# EasyEDA Pro project 天猛星MSPM0.epro, board 2.0
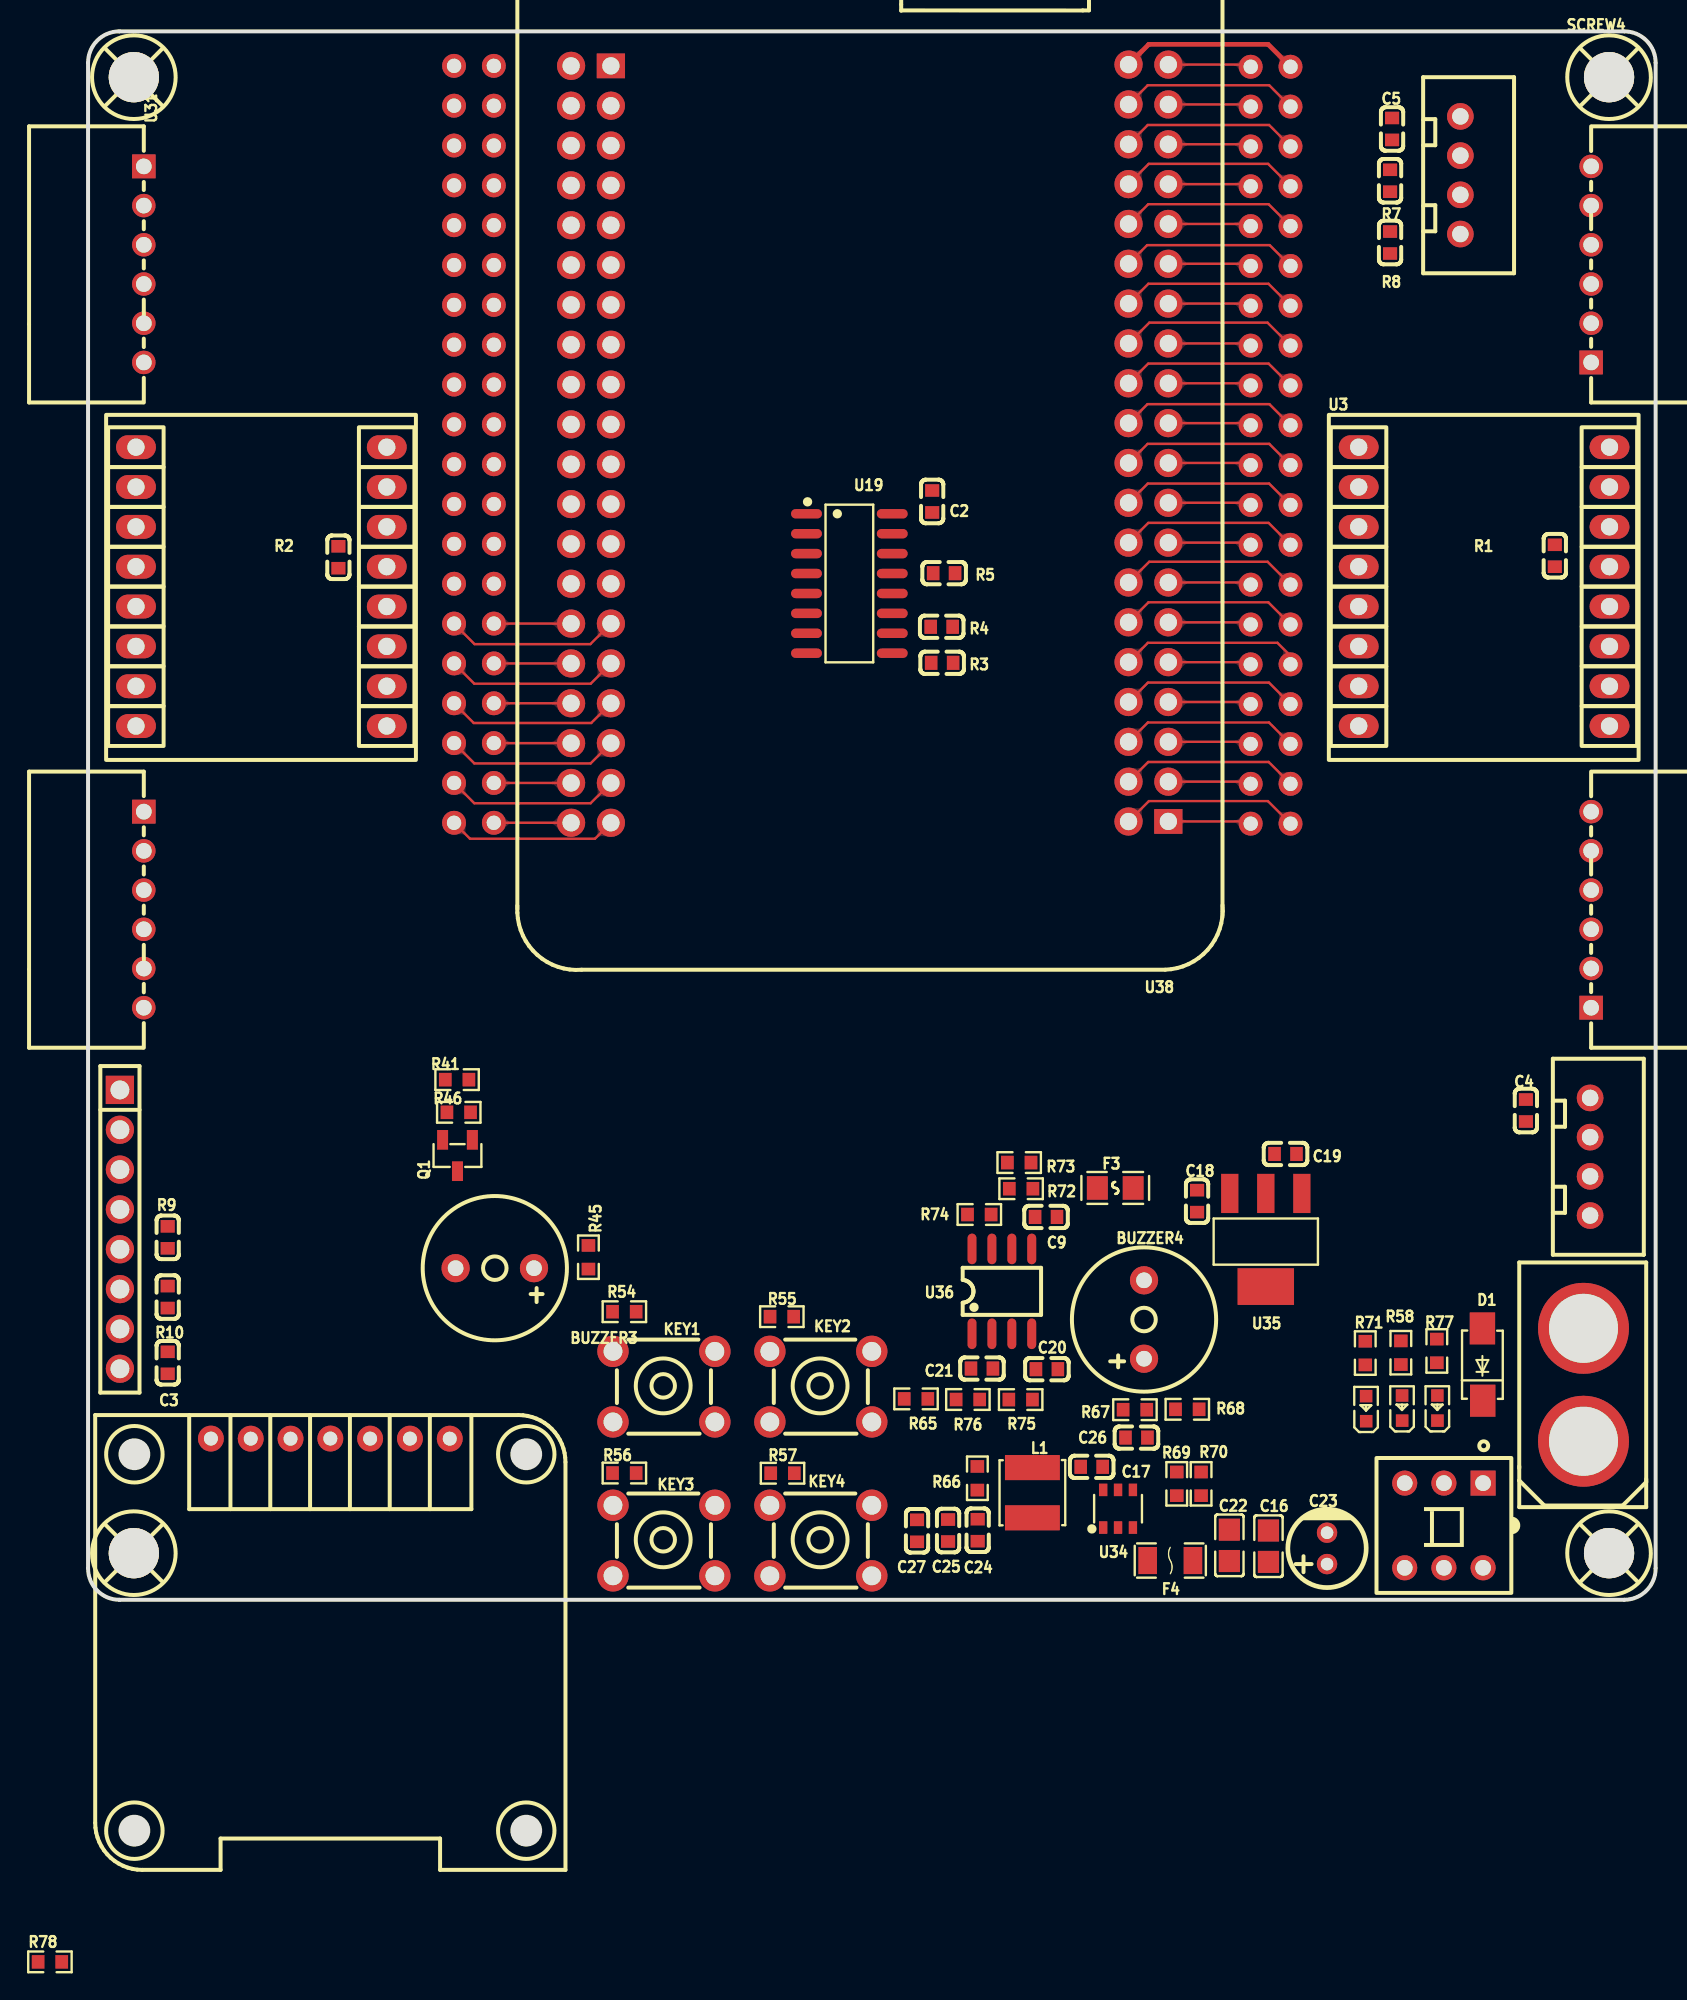
[diagram p1: board, top side]
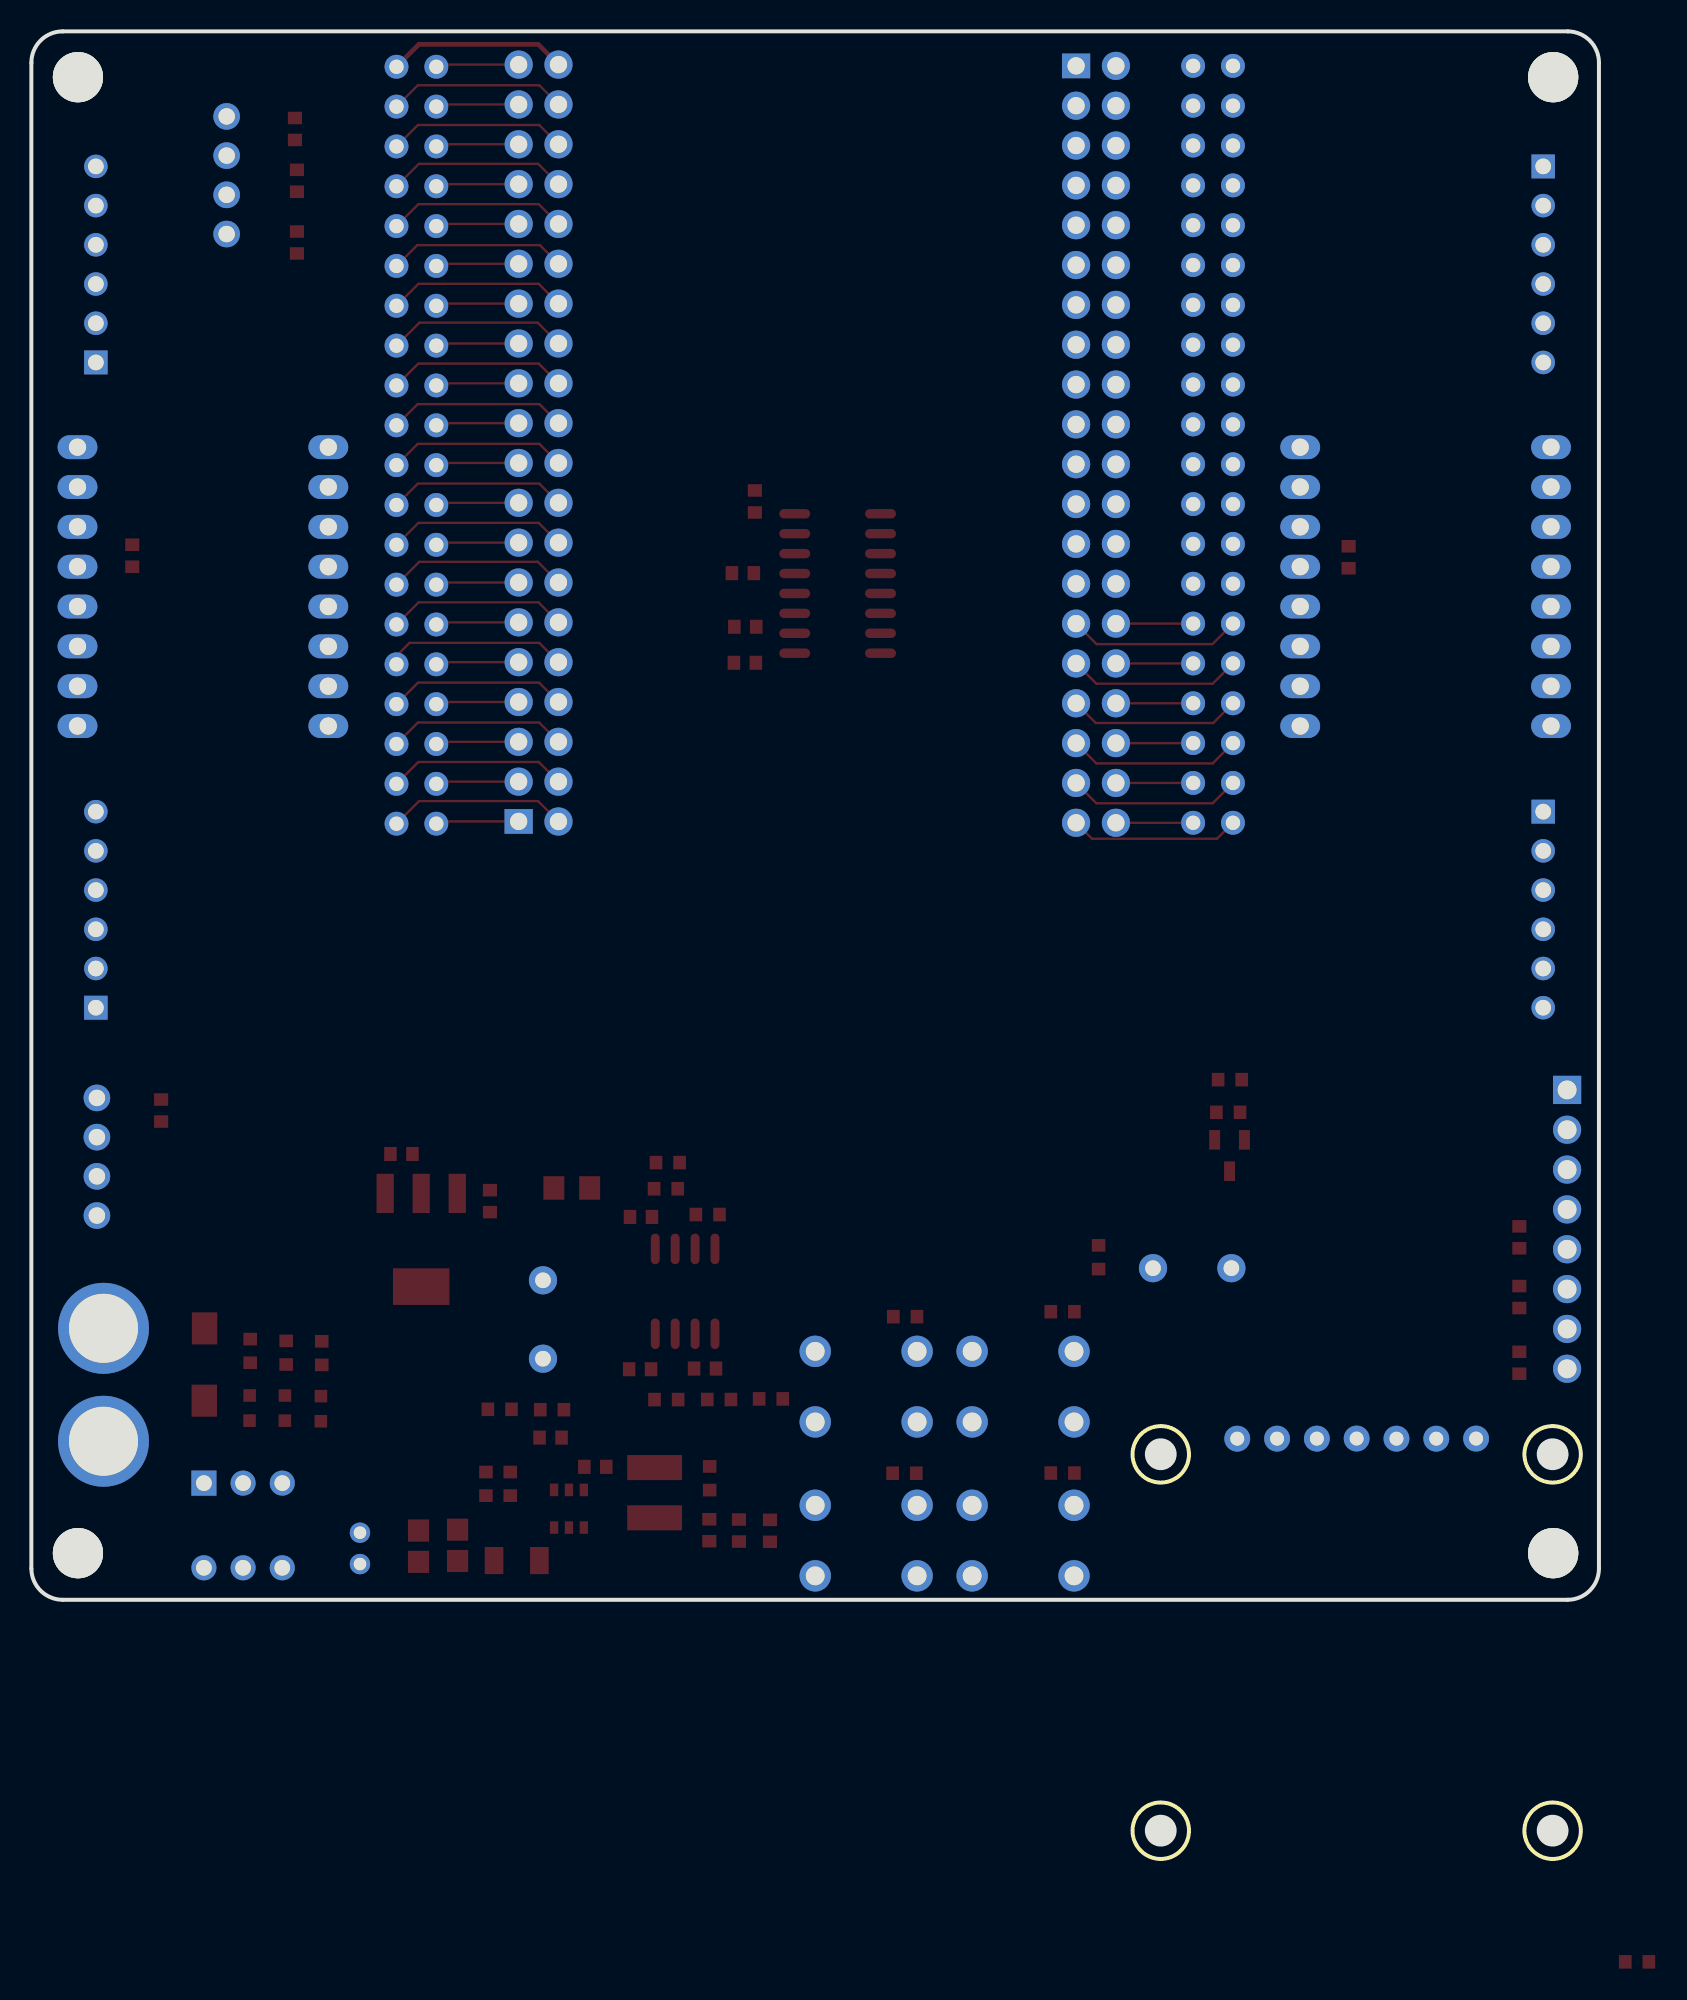
[diagram p2: board, bottom side, seen from below]

Outline 100 x 115.73 mm; copper layers: Top Layer, Bottom Layer. Coordinates in mm from the lower left corner of the outline.
Outline path: 0,113.73 0,17.73 arc(0.59,16.32) 2,15.73 98,15.73 arc(99.41,16.32) 100,17.73 100,113.73 arc(99.41,115.15) 98,115.73 2,115.73 arc(0.59,115.15) 0,113.73
Stack: Top Layer 0.035mm / Dielectric1 1.51mm FR4 er 4.5 / Bottom Layer 0.035mm

## Design rules (mm)
net M2_O2: 12
net M2_O1: 12
net M1_O2: 12
net M1_O1: 12
net 5V: 5
net 12V: 12
net M4_O2: 12
net M4_O1: 12
net M3_O2: 12
net M3_O1: 12
net +3.3V: 3.3
net +12V: 12
net DC5V: 5
net DC12V: 12
template: TI板
spacing copperThickness1oz (default): track to track 0.203, other pairs 0.152 to 0.203
spacing copperThickness2oz: track to track 0.203, other pairs 0.152 to 0.3
track width 信号线 (default): min 0.152, default 0.152, max 0.152
track width 12v: min 0.762, default 0.762, max 0.762
track width 3v3: min 0.3, default 0.3, max 0.4
track width 5电源线: min 0.3, default 0.5, max 2.54
differential pair differentialPair (default): width min 0.152, default 0.152, max 0.152; gap min 0.152, default 0.152
via 信号线孔 (default): diameter min 0.508, default 0.508, max 0.508; hole min 0.254, default 0.254, max 0.305
via 12v: diameter min 0.762, default 1.27, max 2.032; hole min 0.762, default 0.889, max 2.032
via 3v3: diameter min 0.4, default 0.6, max 1; hole min 0.4, default 0.4, max 0.6
via 5v电源: diameter min 0.5, default 0.8, max 10; hole min 0.3, default 0.6, max 6.3
net class 5 uses 5v电源, 5电源线
net class 12 uses 12v
net class 3.3 uses 3v3
net M2_O2 uses 12v
net M2_O1 uses 12v
net M1_O2 uses 12v
net M1_O1 uses 12v
net 5V uses 5v电源, 5电源线
net 12V uses 12v
net M4_O2 uses 12v
net M4_O1 uses 12v
net M3_O2 uses 12v
net M3_O1 uses 12v
net +3.3V uses 3v3
net +12V uses 12v
net DC5V uses 5v电源, 5电源线
net DC12V uses 12v

## Placement (name value [footprint] x y rotation side)
BUZZER3  3kHz  [BUZ-TH_BD9.0-P5.00-D0.6-FD]  25.95 36.88 180 top
BUZZER4  3kHz  [BUZ-TH_BD9.0-P5.00-D0.6-FD]  67.36 33.6 90 top
C2  100nF  [C0603]  53.85 85.76 90 top
C3  100nF  [C0603]  5.08 30.84 270 top
C4  100nF  [C0603]  91.72 46.93 270 top
C5  100nF  [C0603]  83.19 109.51 270 top
C9  100nF  [C0603]  61.11 40.14 180 top
C16  10uF  [C0805]  75.3 19.15 270 top
C17  100nF  [C0603]  64.03 24.21 0 top
C18  100nF  [C0603]  70.75 41.15 90 top
C19  100nF  [C0603]  76.39 44.16 180 top
C20  100nF  [C0603]  61.17 30.44 180 top
C21  1NF  [C0603]  57.02 30.48 0 top
C22  100nF  [C0805]  72.81 19.2 270 top
C23  47uF  [CAP-TH_BD5.0-P2.00-D0.8-FD]  79.04 19.01 90 top
C24  0.1uF  [C0603]  56.75 20.17 90 top
C25  22uF  [C0603]  54.86 20.15 90 top
C26  75pf  [C0603]  66.88 26.07 180 top
C27  22uF  [C0603]  52.88 20.13 90 top
D1  SS54  [SMA_L4.3-W2.6-LS5.0-FD]  88.96 30.73 270 top
F3  SMD0805-050-24  [F0805]  65.53 41.99 0 top
F4  nSMD010  [F1206]  69.04 18.23 180 top
H1  -  [HDR-TH_8P-P2.54-V-F-1]  2.03 39.35 270 top
KEY1  按键开关6*6*8  [KEY-TH_4P-L6.0-W6.0-P4.50-LS7.5]  36.74 29.32 0 top
KEY2  按键开关6*6*8  [KEY-TH_4P-L6.0-W6.0-P4.50-LS7.5]  46.75 29.32 0 top
KEY3  按键开关6*6*8  [KEY-TH_4P-L6.0-W6.0-P4.50-LS7.5]  36.74 19.51 0 top
KEY4  按键开关6*6*8  [KEY-TH_4P-L6.0-W6.0-P4.50-LS7.5]  46.75 19.51 0 top
L1  10uH  [IND-SMD_L4.0-W4.0]  60.24 22.56 270 top
LED2  -  [LED_0603]  83.82 28.01 90 top
LED4  -  [LED_0603]  81.52 27.97 90 top
LED5  -  [LED_0603]  86.07 28.01 90 top
Q1  AO3400A  [SOT-23-3_L2.9-W1.3-P1.90-LS2.4-BR]  23.57 44.06 90 top
R1  10K  [C0603]  93.57 82.3 90 top
R2  10K  [C0603]  15.97 82.2 90 top
R3  10K  [C0603]  54.48 75.47 0 top
R4  10K  [C0603]  54.46 77.77 0 top
R5  10K  [C0603]  54.61 81.19 0 top
R7  4.7K  [C0603]  83.06 106.21 270 top
R8  4.7K  [C0603]  83.06 102.27 90 top
R9  4.7K  [C0603]  5.08 38.84 270 top
R10  4.7K  [C0603]  5.08 35.03 90 top
R41  22R  [R0603]  23.54 48.9 180 top
R45  100R  [R0603]  31.92 37.57 270 top
R46  10K  [R0603]  23.65 46.81 0 top
R54  10K  [R0603]  34.21 34.1 180 top
R55  10K  [R0603]  44.26 33.78 180 top
R56  10K  [R0603]  34.21 23.81 180 top
R57  10K  [R0603]  44.3 23.8 180 top
R58  10K  [R0603]  83.75 31.49 90 top
R65  47K  [R0603]  52.82 28.54 0 top
R66  49.9  [R0603]  56.73 23.48 270 top
R67  100K  [R0603]  66.78 27.85 180 top
R68  13.3K  [R0603]  70.12 27.88 180 top
R69  511K  [R0603]  69.45 23.13 270 top
R70  105K  [R0603]  71 23.13 90 top
R71  2k  [R0603]  81.48 31.46 90 top
R72  100R  [R0603]  59.52 41.94 180 top
R73  10K  [R0603]  59.4 43.61 180 top
R74  75K  [R0603]  56.86 40.3 180 top
R75  150K  [R0603]  59.49 28.5 180 top
R76  36K  [R0603]  56.13 28.5 180 top
R77  5K  [R0603]  86.04 31.6 90 top
R78  0R  [R0603]  -2.43 -7.35 0 top
SCREW1  -  [M3螺丝]  2.92 18.7 0 top
SCREW2  -  [M3螺丝]  97.03 18.7 0 top
SCREW3  -  [M3螺丝]  2.92 112.81 0 top
SCREW4  -  [M3螺丝]  97.03 112.81 0 top
SW2  XKB8585-Z-150  [SW-TH_6P-L8.5-W8.5-P2.50-LS5.4-BL-1]  86.49 20.47 180 top
U3  -  [TB6612]  79 69.23 0 top
U4  -  [TB6612]  1 69.23 0 top
U11  OLED_SPI  [0.96OLED_7P]  15.45 26.01 0 top
U18  PCA9555  [CONN-TH_4P-P2.50-XH2.54-4P]  87.54 106.56 90 top
U19  74HC595D,118  [SOIC-16_L9.9-W3.9-P1.27-LS6.0-BL]  48.57 80.53 270 top
U21  UART1  [CONN-TH_4P-P2.50-XH2.54-4P]  95.82 43.98 90 top
U29  ZX-XH2.54-6PWZ  [CONN-TH_6P-P2.50_ZX-XH2.54-6PWZ]  95.88 100.87 90 top
U30  ZX-XH2.54-6PWZ  [CONN-TH_6P-P2.50_ZX-XH2.54-6PWZ]  95.88 59.73 90 top
U31  ZX-XH2.54-6PWZ  [CONN-TH_6P-P2.50_ZX-XH2.54-6PWZ]  3.56 100.87 270 top
U32  ZX-XH2.54-6PWZ  [CONN-TH_6P-P2.50_ZX-XH2.54-6PWZ]  3.56 59.73 270 top
U34  TPS54302DDCT  [TSOT-23-6_L2.9-W1.6-P0.95-LS2.8-BR]  65.71 21.54 270 top
U35  A1117-3.3  [SOT-223-3_L6.5-W3.4-P2.30-LS7.0-BR-1]  75.13 38.67 90 top
U36  TPS25921ADR  [SOIC-8_L5.0-W4.0-P1.27-LS6.0-BL]  58.29 35.4 0 top
U37  XT60  [CONN-TH_XT60]  95.4 29.44 90 top
U38  LCKFB-TMX-MSPM0G3507  [COMM-TH_LCKFB-TMX-MSPM0G3507]  49.86 89.44 180 top

## Footprints (pads in the part's own frame, mm; a bottom-side part is the same pattern mirrored in y, then rotated)
0.96OLED_7P
  round 1.651 hole 0.889: 1(-7.617,0.003) 2(-5.077,-0.003) 3(-2.538,-0.003) 4(0.003,0.005) 5(2.54,0) 6(5.08,0) 7(7.62,-0.003)
BUZ-TH_BD9.0-P5.00-D0.6-FD
  round 1.8 hole 1: 1(-2.5,0) 2(2.5,0)
C0603
  rect 0.8x0.9 smd: 1(-0.7,0) 2(0.7,0)
C0805
  rect 1.41x1.35 smd: 1(-1,0) 2(1,0)
CAP-TH_BD5.0-P2.00-D0.8-FD
  round 1.3 hole 0.8: 1(-1,0) 2(1,0)
COMM-TH_LCKFB-TMX-MSPM0G3507
  round 1.524 hole 0.914: 1(-24.303,24.227) 2(-26.843,24.227) 3(-24.303,21.688) 4(-26.843,21.688) 5(-24.303,19.148) 6(-26.843,19.148) 7(-24.303,16.608) 8(-26.843,16.608) 9(-24.303,14.068) 10(-26.843,14.068) 11(-24.303,11.527) 12(-26.843,11.527) 13(-24.303,8.988) 14(-26.843,8.988) 15(-24.303,6.447) 16(-26.843,6.447) 17(-24.303,3.908) 18(-26.843,3.908) 19(-24.303,1.367) 20(-26.843,1.367) 21(-24.303,-1.173) 22(-26.843,-1.173) 23(-24.303,-3.712) 24(-26.843,-3.712) 25(-24.303,-6.253) 26(-26.843,-6.253) 27(-24.303,-8.793) 28(-26.843,-8.793) 29(-24.303,-11.332) 30(-26.843,-11.332) 31(-24.303,-13.873) 32(-26.843,-13.873) 33(-24.303,-16.413) 34(-26.843,-16.413) 35(-24.303,-18.953) 36(-26.843,-18.953) 37(-24.303,-21.492) 38(-26.843,-21.492) 39(-24.303,-24.032) 40(-26.843,-24.032) 41(26.517,-24.09) 42(23.977,-24.09) 43(26.517,-21.549) 44(23.977,-21.549) 45(26.517,-19.009) 46(23.977,-19.009) 47(26.517,-16.47) 48(23.977,-16.47) 49(26.517,-13.93) 50(23.977,-13.93) 51(26.517,-11.389) 52(23.977,-11.389) 53(26.517,-8.85) 54(23.977,-8.85) 55(26.517,-6.309) 56(23.977,-6.309) 57(26.517,-3.769) 58(23.977,-3.769) 59(26.517,-1.23) 60(23.977,-1.23) 61(26.517,1.31) 62(23.977,1.31) 63(26.517,3.85) 64(23.977,3.85) 65(26.517,6.391) 66(23.977,6.391) 67(26.517,8.931) 68(23.977,8.931) 69(26.517,11.47) 70(23.977,11.47) 71(26.517,14.011) 72(23.977,14.011) 73(26.517,16.55) 74(23.977,16.55) 75(26.517,19.09) 76(23.977,19.09) 77(26.517,21.631) 78(23.977,21.631) 79(26.517,24.171) 80(23.977,24.171)
  rect 1.8x1.575 hole 1.1: 1(-19.05,24.083) 41(16.51,-24.09)
  round 1.8 hole 1.1: 2(-16.51,24.09) 3(-19.05,21.549) 4(-16.51,21.549) 5(-19.05,19.009) 6(-16.51,19.009) 7(-19.05,16.47) 8(-16.51,16.47) 9(-19.05,13.93) 10(-16.51,13.93) 11(-19.05,11.389) 12(-16.51,11.389) 13(-19.05,8.85) 14(-16.51,8.85) 15(-19.05,6.309) 16(-16.51,6.309) 17(-19.05,3.769) 18(-16.51,3.769) 19(-19.05,1.23) 20(-16.51,1.23) 21(-19.05,-1.31) 22(-16.51,-1.31) 23(-19.05,-3.85) 24(-16.51,-3.85) 25(-19.05,-6.391) 26(-16.51,-6.391) 27(-19.05,-8.931) 28(-16.51,-8.931) 29(-19.05,-11.47) 30(-16.51,-11.47) 31(-19.05,-14.011) 32(-16.51,-14.011) 33(-19.05,-16.55) 34(-16.51,-16.55) 35(-19.05,-19.09) 36(-16.51,-19.09) 37(-19.05,-21.631) 38(-16.51,-21.631) 39(-19.05,-24.171) 40(-16.51,-24.171) 42(19.05,-24.09) 43(16.51,-21.549) 44(19.05,-21.549) 45(16.51,-19.009) 46(19.05,-19.009) 47(16.51,-16.47) 48(19.05,-16.47) 49(16.51,-13.93) 50(19.05,-13.93) 51(16.51,-11.389) 52(19.05,-11.389) 53(16.51,-8.85) 54(19.05,-8.85) 55(16.51,-6.309) 56(19.05,-6.309) 57(16.51,-3.769) 58(19.05,-3.769) 59(16.51,-1.23) 60(19.05,-1.23) 61(16.51,1.31) 62(19.05,1.31) 63(16.51,3.85) 64(19.05,3.85) 65(16.51,6.391) 66(19.05,6.391) 67(16.51,8.931) 68(19.05,8.931) 69(16.51,11.47) 70(19.05,11.47) 71(16.51,14.011) 72(19.05,14.011) 73(16.51,16.55) 74(19.05,16.55) 75(16.51,19.09) 76(19.05,19.09) 77(16.51,21.631) 78(19.05,21.631) 79(16.51,24.171) 80(19.05,24.171)
CONN-TH_4P-P2.50-XH2.54-4P
  round 1.7 hole 1.05: 1(3.75,0) 2(1.25,0) 3(-1.25,0) 4(-3.75,0)
CONN-TH_6P-P2.50_ZX-XH2.54-6PWZ
  rect 1.524x1.5 hole 1: 1(-6.25,0)
  round 1.5 hole 1: 2(-3.75,0) 3(-1.25,0) 4(1.25,0) 5(3.75,0) 6(6.25,0)
CONN-TH_XT60
  round 5.8 hole 4.4: 1(-3.6,0) 2(3.6,0)
F0805
  rect 1.335x1.5 smd: 1(-1.143,0) 2(1.143,0)
F1206
  rect 1.19x1.728 smd: 1(-1.445,0) 2(1.445,0)
HDR-TH_8P-P2.54-V-F-1
  rect 1.8x1.8 hole 1.2: 1(-8.89,0)
  round 1.8 hole 1.2: 2(-6.35,0) 3(-3.81,0) 4(-1.27,0) 5(1.27,0) 6(3.81,0) 7(6.35,0) 8(8.89,0)
IND-SMD_L4.0-W4.0
  rect 1.6x3.5 smd: 1(-1.6,0) 2(1.6,0)
KEY-TH_4P-L6.0-W6.0-P4.50-LS7.5
  round 2 hole 1.2: 1(-3.25,-2.25) 2(3.25,-2.25) 3(3.25,2.25) 4(-3.25,2.25)
LED_0603
  rect 0.8x0.8 smd: 1(-0.851,-0.01) 2(0.75,-0.005)
M3螺丝
  round 3.2 hole 3.2: 1(0,0)
R0603
  rect 0.806x0.864 smd: 1(-0.753,0) 2(0.753,0)
SMA_L4.3-W2.6-LS5.0-FD
  rect 2.046x1.62 smd: 1(-2.304,-0.009) 2(2.304,0.009)
SOIC-8_L5.0-W4.0-P1.27-LS6.0-BL
  oval 0.569x1.95 smd: 1(-1.905,-2.705) 2(-0.635,-2.705) 3(0.635,-2.705) 4(1.905,-2.705) 5(1.905,2.705) 6(0.635,2.705) 7(-0.635,2.705) 8(-1.905,2.705)
SOIC-16_L9.9-W3.9-P1.27-LS6.0-BL
  oval 0.602x1.971 smd: 1(-4.445,-2.736) 2(-3.175,-2.736) 3(-1.905,-2.736) 4(-0.635,-2.736) 5(0.635,-2.736) 6(1.905,-2.736) 7(3.175,-2.736) 8(4.445,-2.736) 9(4.445,2.736) 10(3.175,2.736) 11(1.905,2.736) 12(0.635,2.736) 13(-0.635,2.736) 14(-1.905,2.736) 15(-3.175,2.736) 16(-4.445,2.736)
SOT-23-3_L2.9-W1.3-P1.90-LS2.4-BR
  rect 1.25x0.7 smd: 1(1,-0.95) 2(1,0.95) 3(-1,0)
SOT-223-3_L6.5-W3.4-P2.30-LS7.0-BR-1
  rect 2.5x1.1 smd: 1(2.97,-2.3) 2(2.97,0) 3(2.97,2.3)
  rect 2.34x3.6 smd: 2(-2.97,0)
SW-TH_6P-L8.5-W8.5-P2.50-LS5.4-BL-1
  rect 1.6x1.6 hole 1: 1(-2.5,-2.7)
  round 1.6 hole 1: 2(0,-2.7) 3(2.5,-2.7) 4(2.5,2.7) 5(0.001,2.7) 6(-2.5,2.7)
TB6612
  oval 2.54x1.524 hole 1.1: 1(2.057,19.988) 2(2.057,17.448) 3(2.057,14.908) 4(2.057,12.368) 5(2.057,9.828) 6(2.057,7.288) 7(2.057,4.748) 8(2.057,2.208) 9(18.057,2.208) 10(18.057,4.748) 11(18.057,7.288) 12(18.057,9.828) 13(18.057,12.368) 14(18.057,14.908) 15(18.057,17.448) 16(18.057,19.988)
TSOT-23-6_L2.9-W1.6-P0.95-LS2.8-BR
  rect 0.8x0.532 smd: 1(1.2,-0.95) 2(1.2,0) 3(1.2,0.95) 4(-1.2,0.95) 5(-1.2,0) 6(-1.2,-0.95)

## Nets
As in the schematic.

Pads without a net: H1 1 2 3 4; KEY1 2 3; KEY2 2 3; KEY3 2 3; KEY4 2 3; SCREW1 1; SCREW2 1; SCREW3 1; SCREW4 1; SW2 3 4 5 6; U38 4 6 9 12 14 19 20 22 24 32 33 34 36 38 42 44 45 46 47 48 51 52 53 54 55 56 58 60 61 62 64 67 73 74 76

## Routing (per net, layer and track width the routed paths; a pad name or vN(x,y) marks a point on that pad's centre or on a via; arc(x,y) is an arc through that point)
5V: length 11.5
  Top Layer w0.3: U38.40 75.28,114.91 67.67,114.91 U38.40
AGND: length 5.3
  Top Layer w0.152: U38.35 74.03,108.53 U38.35
GND: length 53.8
  Top Layer w0.152: U38.37 74.03,111.07 U38.37 ; U38.2 67.68,66.66 75.27,66.66 U38.2 ; U38.21 74.03,90.75 U38.21 ; U38.39 74.03,113.61 U38.39 ; U38.23 74.03,93.29 U38.23 ; U38.1 74.02,65.36 U38.1 ; 23.35,65.27 24.36,64.26 32.34,64.26 U38.79 ; 25.89,65.27 U38.80
(no net): length 162.5
  Top Layer w0.152: U38.19 74.03,88.21 U38.19 ; 23.35,72.89 24.61,71.63 32.1,71.63 U38.73 ; U38.4 67.63,69.15 75.31,69.15 U38.4 ; U38.33 74.03,105.99 U38.33 ; U38.14 75.25,81.91 67.69,81.91 U38.14 ; U38.20 67.59,89.43 75.35,89.43 U38.20 ; U38.34 75.28,107.28 67.66,107.28 U38.34 ; U38.22 75.36,91.96 67.58,91.96 U38.22 ; U38.6 75.34,71.67 67.61,71.67 U38.6 ; U38.12 67.65,79.33 75.29,79.33 U38.12 ; U38.38 75.35,112.3 67.6,112.3 U38.38 ; U38.24 67.63,94.55 75.31,94.55 U38.24 ; U38.9 74.03,75.51 U38.9 ; 25.89,70.35 U38.76 ; U38.32 75.31,104.72 67.64,104.72 U38.32 ; 25.89,72.89 U38.74 ; U38.36 75.34,109.76 67.6,109.76 U38.36
595DS: length 11.1
  Top Layer w0.152: 23.35,70.35 24.64,69.06 32.06,69.06 U38.75
595SHCP: length 4.9
  Top Layer w0.152: 25.89,77.97 U38.70
595STCP: length 11.1
  Top Layer w0.152: U38.69 32.04,76.66 24.66,76.66 23.35,77.97
BEEP: length 11.1
  Top Layer w0.152: 23.35,67.81 24.64,66.52 32.06,66.52 U38.77
KEY1: length 11.4
  Top Layer w0.152: U38.16 75.31,84.39 67.63,84.39 U38.16
KEY2: length 5.3
  Top Layer w0.152: U38.27 74.03,98.37 U38.27
KEY3: length 11.4
  Top Layer w0.152: U38.28 67.64,99.64 75.3,99.64 U38.28
M1_E1: length 11.4
  Top Layer w0.152: U38.8 67.61,74.21 75.33,74.21 U38.8
M1_E2: length 11.7
  Top Layer w0.152: U38.10 76.65,75.43 76.65,75.97 75.87,76.75 67.61,76.75 U38.10
M1_PWM: length 5.3
  Top Layer w0.152: U38.3 74.03,67.89 U38.3
M2_E1: length 5.3
  Top Layer w0.152: U38.25 74.03,95.83 U38.25
M2_E2: length 11.5
  Top Layer w0.152: U38.26 75.24,97.16 67.7,97.16 U38.26
M2_PWM: length 5.3
  Top Layer w0.152: U38.5 74.03,70.43 U38.5
M4_E1: length 5.3
  Top Layer w0.152: U38.31 74.03,103.45 U38.31
M4_E2: length 11.4
  Top Layer w0.152: U38.18 67.6,86.9 75.34,86.9 U38.18
M4_PWM: length 4.9
  Top Layer w0.152: 25.89,75.43 U38.72
OLED_CS: length 11.1
  Top Layer w0.152: U38.71 32.06,74.14 24.64,74.14 23.35,75.43
OLED_RST: length 5.3
  Top Layer w0.152: U38.13 74.03,80.59 U38.13
OLED_SDA: length 5.3
  Top Layer w0.152: U38.11 74.03,78.05 U38.11
RX1: length 5.3
  Top Layer w0.152: U38.17 74.03,85.67 U38.17
SCL1: length 5.3
  Top Layer w0.152: U38.29 74.03,100.91 U38.29
SCL2: length 5.3
  Top Layer w0.152: U38.7 74.03,72.97 U38.7
SDA1: length 11.4
  Top Layer w0.152: U38.30 75.38,102.1 67.56,102.1 U38.30
SDA2: length 4.9
  Top Layer w0.152: 25.89,67.81 U38.78
TX1: length 5.3
  Top Layer w0.152: U38.15 74.03,83.13 U38.15

Small or netless copper shapes (teardrops, artwork), in the pictures only: 105 on Top Layer
